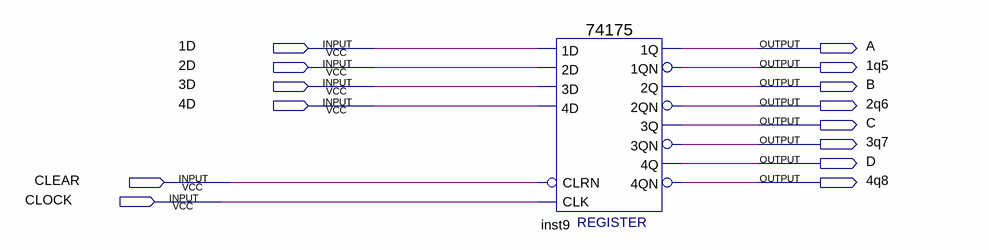
[diagram p0: schematic sheet]
// Quartus schematic pipoRegister2.bdf as structural Verilog: 1 symbols, 14 pins
module pipoRegister2 (
  input  \1D ,
  input  \2D ,
  input  \3D ,
  input  \4D ,
  input  CLEAR,
  input  CLOCK,
  output A,
  output \1q5 ,
  output B,
  output \2q6 ,
  output C,
  output \3q7 ,
  output D,
  output \4q8 
);

  \74175  inst9 (
    .CLRN(CLEAR), .CLK(CLOCK), .\3D (\3D ), .\2D (\2D ), .\1D (\1D ), .\4D (\4D ), .\1QN (\1q5 ), .\1Q (A),
    .\2QN (\2q6 ), .\3Q (C), .\2Q (B), .\4QN (\4q8 ), .\4Q (D), .\3QN (\3q7 ));
endmodule
